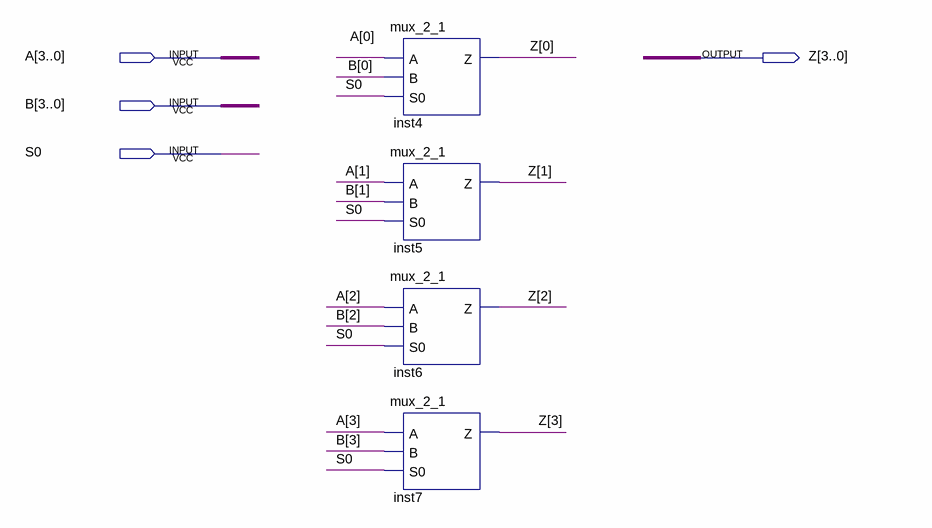
[diagram p0: schematic sheet]
// Quartus schematic mux_2_1_4b.bdf as structural Verilog: 4 symbols, 4 pins
module mux_2_1_4b (
  input  [3:0] A,
  input  [3:0] B,
  input  S0,
  output [3:0] Z
);

  mux_2_1 inst4 (.A(A[0]), .B(B[0]), .S0(S0), .Z(Z[0]));
  mux_2_1 inst5 (.A(A[1]), .B(B[1]), .S0(S0), .Z(Z[1]));
  mux_2_1 inst6 (.A(A[2]), .B(B[2]), .S0(S0), .Z(Z[2]));
  mux_2_1 inst7 (.A(A[3]), .B(B[3]), .S0(S0), .Z(Z[3]));
endmodule
